# Altium schematic sheet interface.SchDoc
size A3
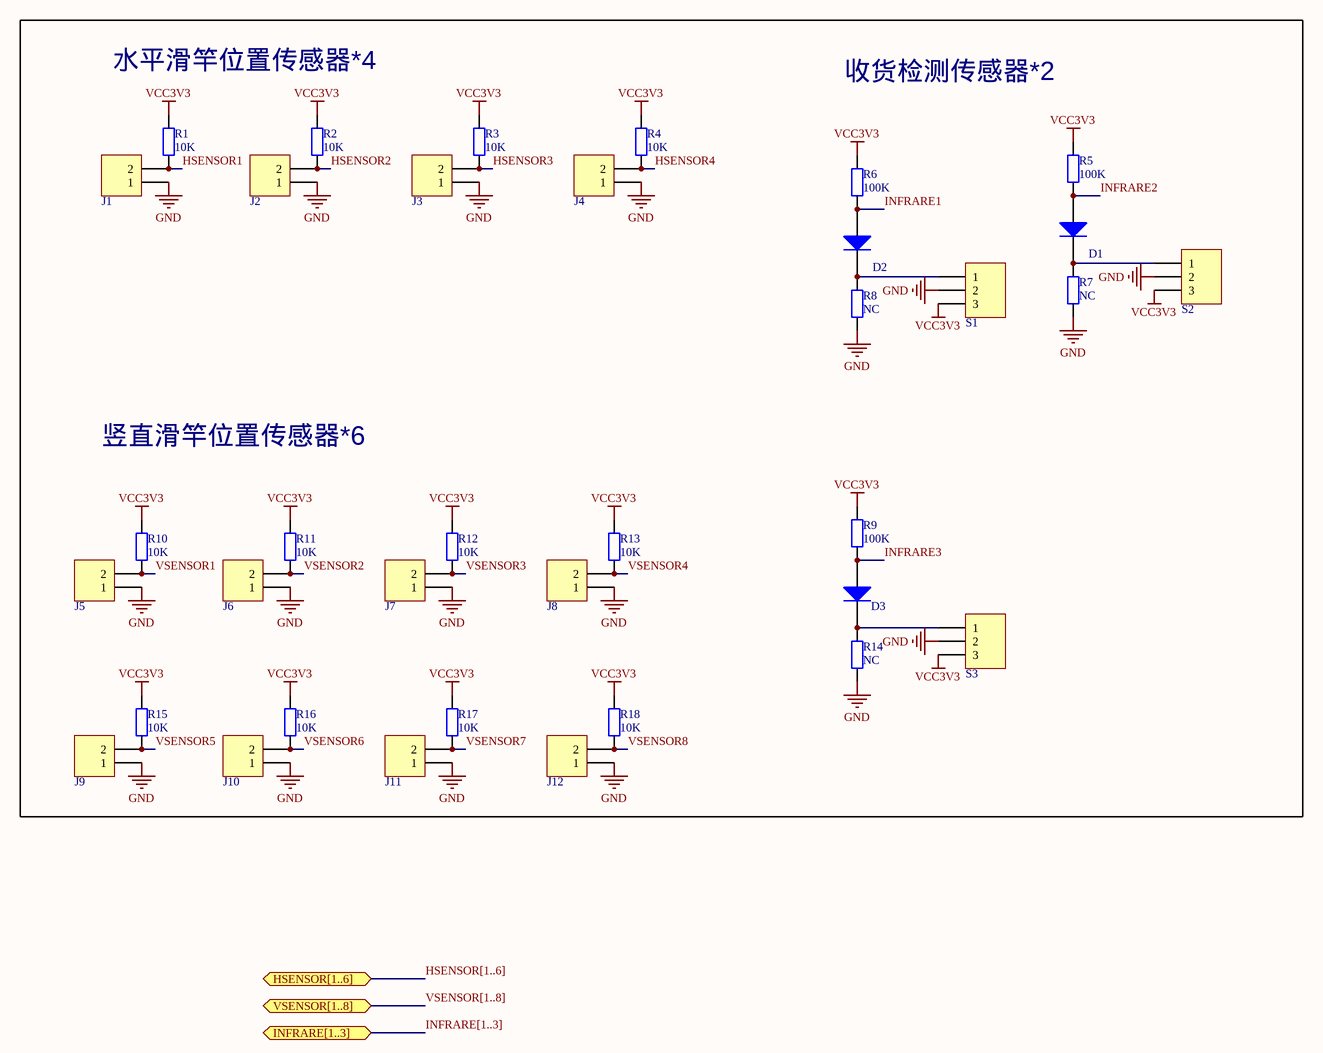
[diagram p0: interface.SchDoc]

## Parts
D1  Diode_SOD323  [SOD323_D]  (value not drawn)
D2  Diode_SOD323  [SOD323_D]  (value not drawn)
D3  Diode_SOD323  [SOD323_D]  (value not drawn)
J1  XHB2.54-2PIN-带锁扣  [SIP2]  (value not drawn)
J2  XHB2.54-2PIN-带锁扣  [SIP2]  (value not drawn)
J3  XHB2.54-2PIN-带锁扣  [SIP2]  (value not drawn)
J4  XHB2.54-2PIN-带锁扣  [SIP2]  (value not drawn)
J5  XHB2.54-2PIN-带锁扣  [SIP2]  (value not drawn)
J6  XHB2.54-2PIN-带锁扣  [SIP2]  (value not drawn)
J7  XHB2.54-2PIN-带锁扣  [SIP2]  (value not drawn)
J8  XHB2.54-2PIN-带锁扣  [SIP2]  (value not drawn)
J9  XHB2.54-2PIN-带锁扣  [SIP2]  (value not drawn)
J10  XHB2.54-2PIN-带锁扣  [SIP2]  (value not drawn)
J11  XHB2.54-2PIN-带锁扣  [SIP2]  (value not drawn)
J12  XHB2.54-2PIN-带锁扣  [SIP2]  (value not drawn)
R1  型号: 10K  [0603R]  (hidden comment: Res_0603)
R2  型号: 10K  [0603R]  (hidden comment: Res_0603)
R3  型号: 10K  [0603R]  (hidden comment: Res_0603)
R4  型号: 10K  [0603R]  (hidden comment: Res_0603)
R5  型号: 100K  [0603R]  (hidden comment: Res_0603)
R6  型号: 100K  [0603R]  (hidden comment: Res_0603)
R7  型号: NC  [0603R]  (hidden comment: Res_0603)
R8  型号: NC  [0603R]  (hidden comment: Res_0603)
R9  型号: 100K  [0603R]  (hidden comment: Res_0603)
R10  型号: 10K  [0603R]  (hidden comment: Res_0603)
R11  型号: 10K  [0603R]  (hidden comment: Res_0603)
R12  型号: 10K  [0603R]  (hidden comment: Res_0603)
R13  型号: 10K  [0603R]  (hidden comment: Res_0603)
R14  型号: NC  [0603R]  (hidden comment: Res_0603)
R15  型号: 10K  [0603R]  (hidden comment: Res_0603)
R16  型号: 10K  [0603R]  (hidden comment: Res_0603)
R17  型号: 10K  [0603R]  (hidden comment: Res_0603)
R18  型号: 10K  [0603R]  (hidden comment: Res_0603)
S1  TJC3-2.54直座  [SIP3]  (value not drawn)
S2  TJC3-2.54直座  [SIP3]  (value not drawn)
S3  TJC3-2.54直座  [SIP3]  (value not drawn)

## Ports
HSENSOR[1..6], INFRARE[1..3], VSENSOR[1..8]

## Nets
GND: J1.1 J2.1 J3.1 J4.1 J5.1 J6.1 J7.1 J8.1 J9.1 J10.1 J11.1 J12.1 R7.1 R8.1 R14.1 S1.2 S2.2 S3.2
VCC3V3: R1.1 R2.1 R3.1 R4.1 R5.2 R6.2 R9.2 R10.1 R11.1 R12.1 R13.1 R15.1 R16.1 R17.1 R18.1 S1.3 S2.3 S3.3
HSENSOR1: J1.2 R1.2
HSENSOR2: J2.2 R2.2
HSENSOR3: J3.2 R3.2
HSENSOR4: J4.2 R4.2
INFRARE1: D2.1 R6.1
INFRARE2: D1.1 R5.1
INFRARE3: D3.1 R9.1
VSENSOR1: J5.2 R10.2
VSENSOR2: J6.2 R11.2
VSENSOR3: J7.2 R12.2
VSENSOR4: J8.2 R13.2
VSENSOR5: J9.2 R15.2
VSENSOR6: J10.2 R16.2
VSENSOR7: J11.2 R17.2
VSENSOR8: J12.2 R18.2
NetD1_2: D1.2 R7.2 S2.1
NetD2_2: D2.2 R8.2 S1.1
NetD3_2: D3.2 R14.2 S3.1

## Buses and harness runs
bus HSENSOR[1..6] = port HSENSOR[1..6]
bus INFRARE[1..3] = port INFRARE[1..3]
bus VSENSOR[1..8] = port VSENSOR[1..8]

## Notes on the sheet
- 水平滑竿位置传感器*4
- 收货检测传感器*2
- 竖直滑竿位置传感器*6

## Library data of the parts
D1-D3 = Diode_SOD323: Default Diode; Published: 8-Jun-2000; LatestRevisionDate: 17-Jul-2002; LatestRevisionNote: Re-released for DXP Platform.; PackageVersion: Sep-1996; PackageReference: SMC; Publisher: Altium Limited; PackageDescription: DO-214-AB/SMC; 2 C-Bend Leads; Body 7.9 x 5.9 mm, inc. leads (LxW); Code_JEDEC: DO-214-AB
J1-J12 = XHB2.54-2P直座: Header, 4-Pin; 名称: 插接件; 容差: *; 参考网址: *; 型号: XHB2.54-2PIN-带锁扣
R1-R18 = Res_0603: Resistor; 名称: 贴片电阻; 容差: 5%; 参考网址: *
S1-S3 = TJC3-2.54直座: Header, 3-Pin; 名称: 插接件; 型号: PH2.0-3PIN-直座; 容差: *; 参考网址: *